# EAGLE design FaboBoard (EAGLE 7.2.0)
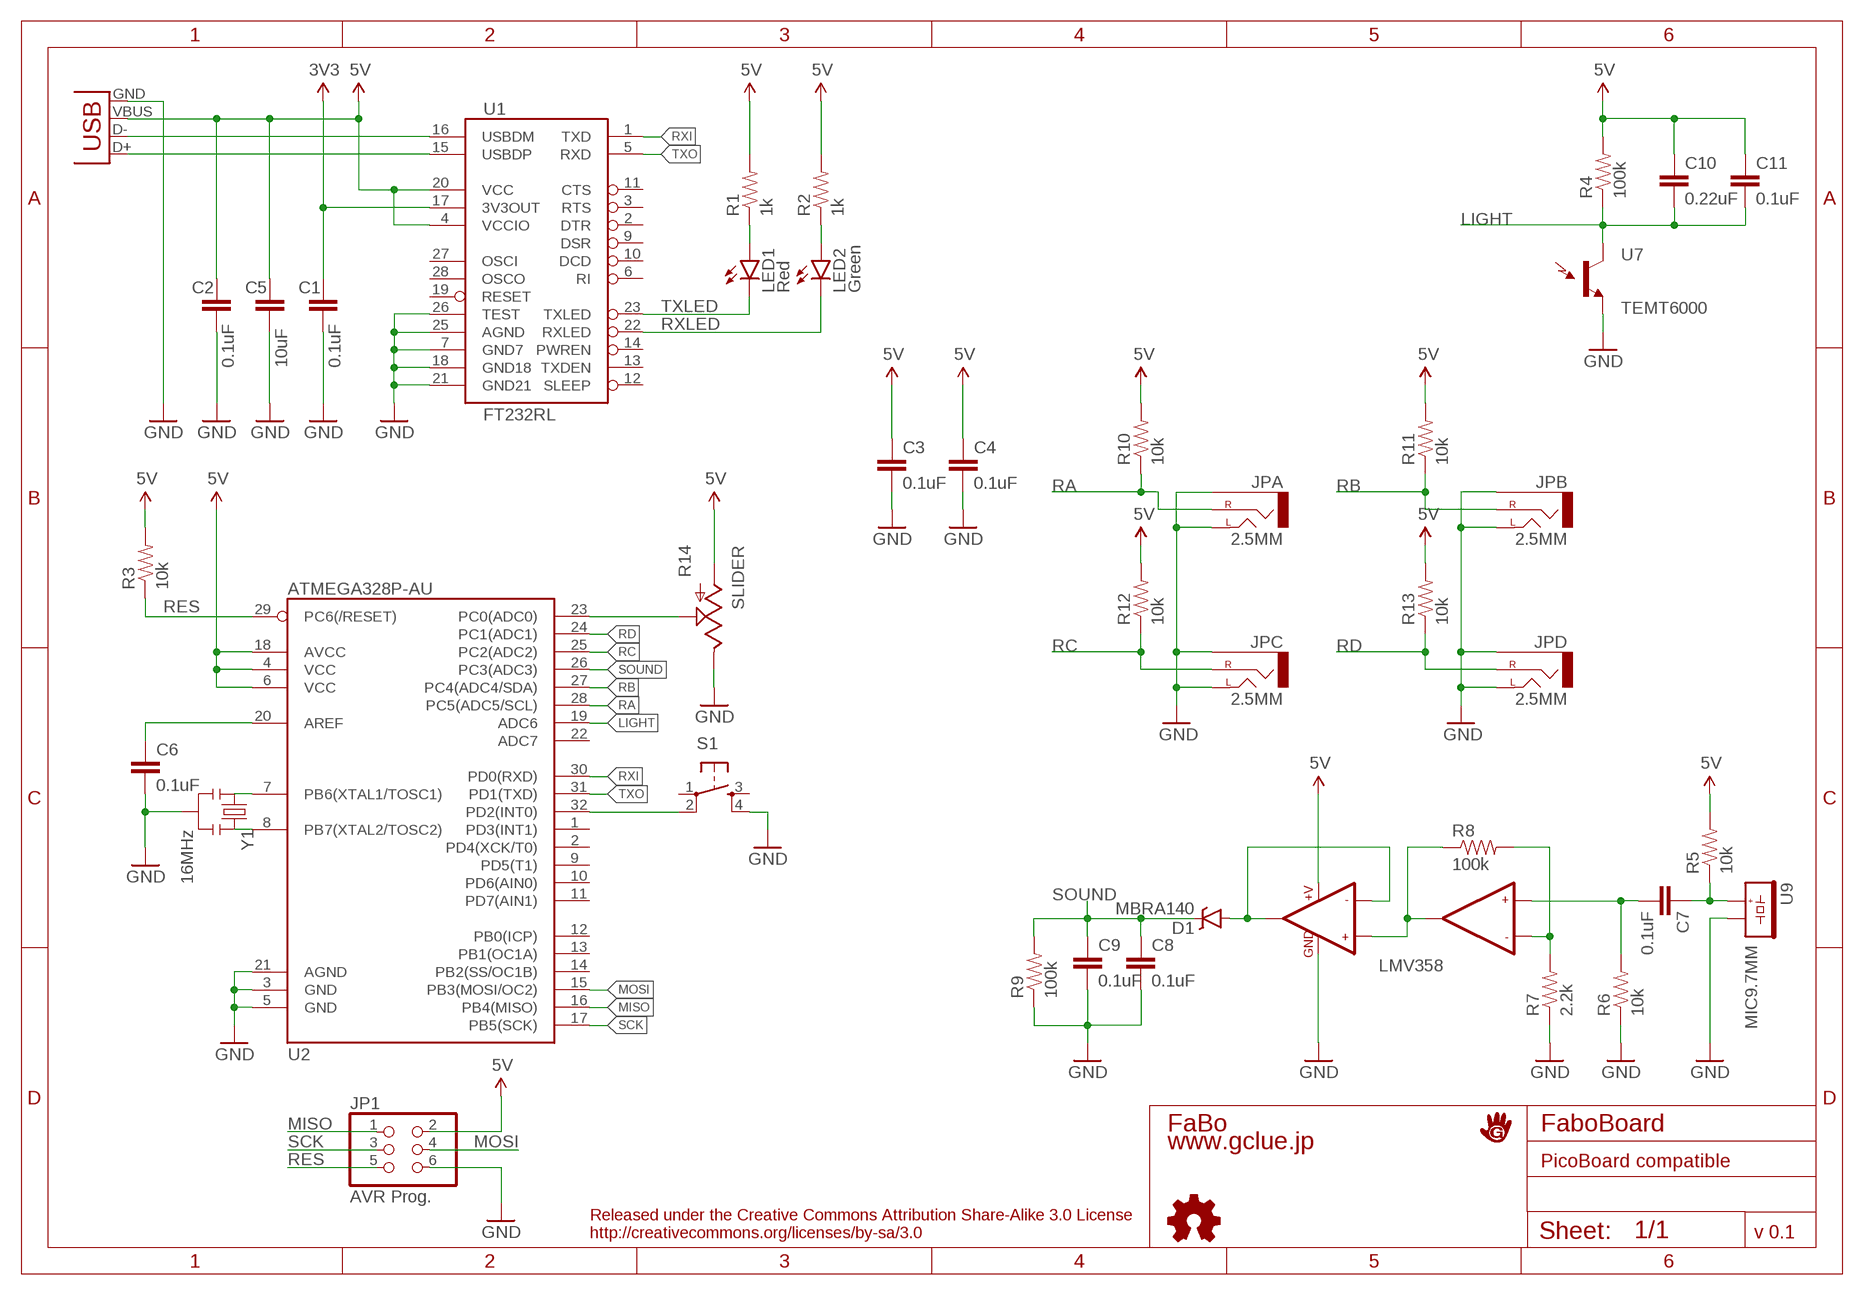
[diagram p0: schematic, sheet 1]

## Parts
C1  0.1uF  CAPACITOR0603  [EIA0603-CAP]
C2  0.1uF  CAPACITOR0603  [EIA0603-CAP]
C3  0.1uF  CAPACITOR0603  [EIA0603-CAP]
C4  0.1uF  CAPACITOR0603  [EIA0603-CAP]
C5  10uF  CAPACITOR1206  [EIA1206]
C6  0.1uF  CAPACITOR0603  [EIA0603-CAP]
C7  0.1uF  CAPACITOR0603  [EIA0603-CAP]
C8  0.1uF  CAPACITOR0603  [EIA0603-CAP]
C9  0.1uF  CAPACITOR0603  [EIA0603-CAP]
C10  0.22uF  CAPACITOR0603  [EIA0603-CAP]
C11  0.1uF  CAPACITOR0603  [EIA0603-CAP]
D1  MBRA140  [DIODE-SMA]
JP1  AVR Prog.  PINHD-2X3  [2X03]
JPA  2.5MM  STEREOJACK_2.5MM_SMD  [STEREOJACK_2.5MM_SMD]
JPB  2.5MM  STEREOJACK_2.5MM_SMD  [STEREOJACK_2.5MM_SMD]
JPC  2.5MM  STEREOJACK_2.5MM_SMD  [STEREOJACK_2.5MM_SMD]
JPD  2.5MM  STEREOJACK_2.5MM_SMD  [STEREOJACK_2.5MM_SMD]
LED1  Red  LED-EIA0603  [EIA0603-LED]
LED2  Green  LED-EIA0603  [EIA0603-LED]
R1  1k  RESISTOR0603  [EIA0603-RES]
R2  1k  RESISTOR0603  [EIA0603-RES]
R3  10k  RESISTOR0603  [EIA0603-RES]
R4  100k  RESISTOR0603  [EIA0603-RES]
R5  10k  RESISTOR0603  [EIA0603-RES]
R6  10k  RESISTOR0603  [EIA0603-RES]
R7  2.2k  RESISTOR0603  [EIA0603-RES]
R8  100k  RESISTOR0603  [EIA0603-RES]
R9  100k  RESISTOR0603  [EIA0603-RES]
R10  10k  RESISTOR0603  [EIA0603-RES]
R11  10k  RESISTOR0603  [EIA0603-RES]
R12  10k  RESISTOR0603  [EIA0603-RES]
R13  10k  RESISTOR0603  [EIA0603-RES]
R14  SLIDER  SLIDER60MM  [SLIDER_60MM]
S1  SWITCH-TL3300CF160Q  [TACT-SMD-12MM-TL3300CF160Q]
U1  FT232RL  [SSOP28]
U2  ATMEGA328P-AU  [TQFP-32-08]
U7  TEMT6000  [TEMT6000]
U8  LMV358  [SO8-OP]
U9  MIC9.7MM  MIC-ECM  [MIC-ECM]
U$2  LOGO_GCLUE  [LOGO_GCLUE]
U$3  LOGO_OSHW-S  [LOGO_OSHW_S]
USB1  USBMICRO_SMD  [USB_B_MICRO]
Y1  16MHz  RESONATOR  [RESONATOR_SMD]

## Nets
3V3 [power]: C1.1 U1.17(3V3OUT)
5V: C2.1 C3.1 C4.1 C5.1 C10.1 C11.1 JP1.2 R1.2 R2.2 R3.2 R4.2 R5.2 R10.2 R11.2 R12.2 R13.2 R14.3 U1.4(VCCIO) U1.20(VCC) U2.4(VCC) U2.6(VCC) U2.18(AVCC) U8.8(+V) USB1.VBUS
GND [power]: C1.2 C2.2 C3.2 C4.2 C5.2 C6.2 C8.2 C9.2 JP1.6 JPA.1(LEFT) JPA.5(SLEEVE) JPB.1(LEFT) JPB.5(SLEEVE) JPC.1(LEFT) JPC.5(SLEEVE) JPD.1(LEFT) JPD.5(SLEEVE) R6.1 R7.1 R9.1 R14.1 S1.4 U1.7(GND7) U1.18(GND18) U1.21(GND21) U1.25(AGND) U1.26(TEST) U2.3(GND) U2.5(GND) U2.21(AGND) U7.EMITTER(E1) U8.4(GND) U9.- USB1.GND Y1.2
LIGHT: C10.2 C11.2 R4.1 U2.19(ADC6) U7.COLLECTOR(C1)
MISO: JP1.1 U2.16(PB4(MISO))
MOSI: JP1.4 U2.15(PB3(MOSI/OC2))
N$1: LED1.A R1.1
N$2: LED2.A R2.1
N$3: R7.2 R8.2 U8.6(-IN2)
N$5: U2.7(PB6(XTAL1/TOSC1)) Y1.1
N$6: U2.8(PB7(XTAL2/TOSC2)) Y1.3
N$7: C6.1 U2.20(AREF)
N$8: S1.2 U2.32(PD2(INT0))
N$9: C7.1 R5.1 U9.+
N$10: R14.2 U2.23(PC0(ADC0))
N$11: C7.2 R6.2 U8.5(+IN2)
N$13: D1.A U8.1(OUT1) U8.2(-IN1)
N$16: R8.1 U8.3(+IN1) U8.7(OUT2)
RA: JPA.4(RIGHT) R10.1 U2.28(PC5(ADC5/SCL))
RB: JPB.4(RIGHT) R11.1 U2.27(PC4(ADC4/SDA))
RC: JPC.4(RIGHT) R12.1 U2.25(PC2(ADC2))
RD: JPD.4(RIGHT) R13.1 U2.24(PC1(ADC1))
RES: JP1.5 R3.1 U2.29(PC6(/RESET))
RXI: U1.1(TXD) U2.30(PD0(RXD))
RXLED: LED2.C U1.22(RXLED)
SCK: JP1.3 U2.17(PB5(SCK))
SOUND: C8.1 C9.1 D1.C R9.2 U2.26(PC3(ADC3))
TXLED: LED1.C U1.23(TXLED)
TXO: U1.5(RXD) U2.31(PD1(TXD))
USB_D+: U1.15(USBDP) USB1.D+
USB_D-: U1.16(USBDM) USB1.D-
Unconnected: S1.1 S1.3 U1.2(DTR) U1.3(RTS) U1.6(RI) U1.9(DSR) U1.10(DCD) U1.11(CTS) U1.12(SLEEP) U1.13(TXDEN) U1.14(PWREN) U1.19(RESET) U1.27(OSCI) U1.28(OSCO) U2.1(PD3(INT1)) U2.2(PD4(XCK/T0)) U2.9(PD5(T1)) U2.10(PD6(AIN0)) U2.11(PD7(AIN1)) U2.12(PB0(ICP)) U2.13(PB1(OC1A)) U2.14(PB2(SS/OC1B)) U2.22(ADC7)

## Notes on the sheet
- PicoBoard compatible
- Released under the Creative Commons Attribution Share-Alike 3.0 License
- http://creativecommons.org/licenses/by-sa/3.0 | v 0.1

## Library data of the parts
C1-C11 = Gclue:CAPACITOR: Capacitor
D1 = Gclue:MBRA140: MBRA140 Schottky Diodes 1A 40V
JP1 = pinhead:PINHD-2X3: PIN HEADER
JPA JPB JPC JPD = Gclue:STEREOJACK_2.5MM_SMD
LED1 LED2 = Gclue:LED: LED
R1-R13 = Gclue:RESISTOR
R14 = Gclue:SLIDER: SLIDER
S1 = Gclue:SWITCH-TL3300CF160Q: Tact Switch SMD 12mm
U1 = Gclue:FT232RL: FT232RL FTDI FT232RL USB to serial UART interface SSOP28
U2 = Gclue:ATMEGA328P-AU: ATmega328p-AU
U7 = gclueSensor:TEMT6000: TEMT6000 Ambient Light Sensor
U8 = Gclue:LMV358: LMV358 Low-Voltage Rail-to-Rail Output OpAmp
U9 = Gclue:MIC-ECM: ECM Microphone C9767
U$2 = Gclue:LOGO_GCLUE
U$3 = Gclue:LOGO_OSHW
USB1 = Gclue:USB
Y1 = Gclue:RESONATOR: RESONATOR CSTCE16M0V53

## Net classes
0 default: width 0.203 mm
1 power: width 0.254 mm
2 GND: width 0.254 mm

## Board
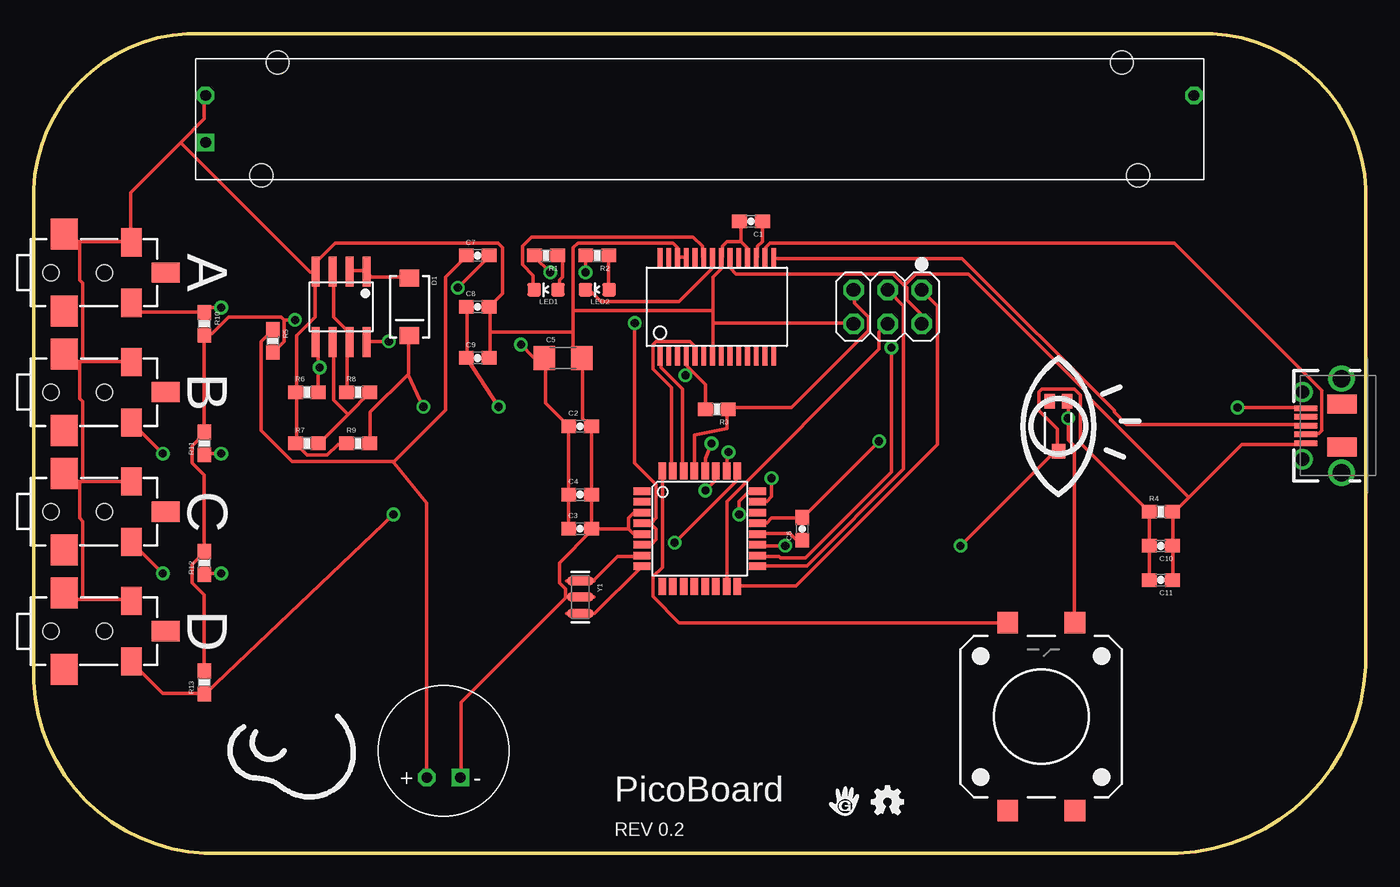
[diagram p1: board, top side]
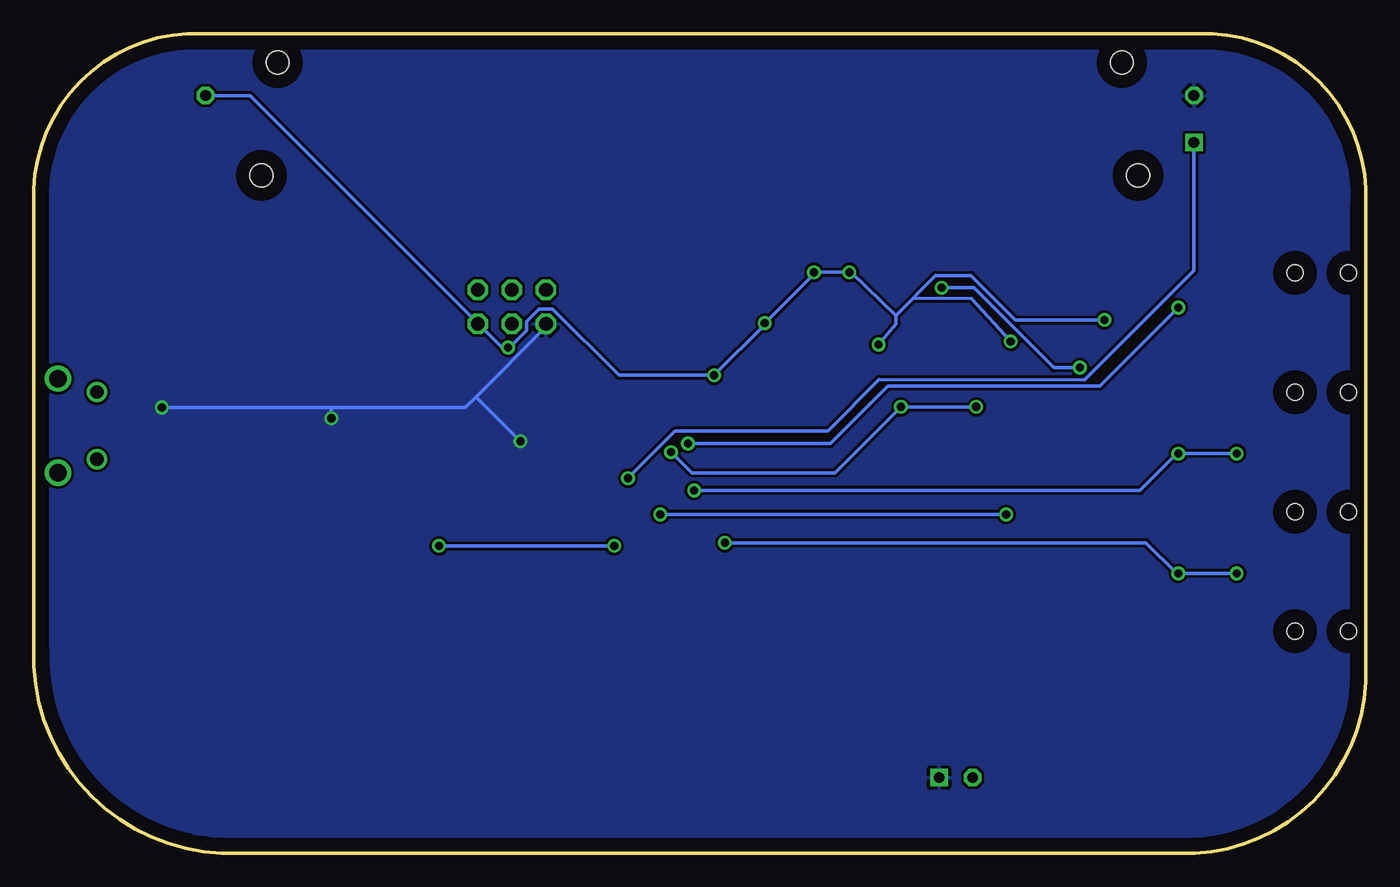
[diagram p2: board, bottom side, seen from below]

Size 99.07 x 60.96 mm. Coordinates in mm from the lower left corner, seen from the top.
Outline: 85.1,0 12.71,0 arc-90 0.01,13.97 0.01,48.26 arc-90 11.44,60.96 87.64,60.96 arc-90 99.07,48.26 99.07,15.24 arc-90 85.1,0
Copper layers (1*16): Top 0.035mm / dielectric 1.5mm / Bottom 0.035mm
Design rules "default": minimum track width 10mil, minimum drill 24mil, track to track 8mil, track to pad 8mil, pad to pad 8mil, via to via 8mil, smd to smd 8mil, copper to edge 40mil, drill to drill 8mil, minimum pad ring 10mil, minimum via ring 8mil, stop-mask expansion 4mil, vias tented up to drill 0mil, thermal gap 10mil

### Footprints (pad centres in the part's own frame; a part is rotated, then mirrored left to right if it is on the bottom)
EIA0603-CAP = smd 1.1 x 1: 1 -0.85,0; 2 0.85,0
EIA1206 = smd 1.6 x 1.8: 1 -1.4,0; 2 1.4,0
DIODE-SMA = smd 1.27 x 1.47: A -2.15,0; C 2.15,0
2X03 = drill 1.016 octagon: 1 -2.54,-1.27; 2 -2.54,1.27; 3 0,-1.27; 4 0,1.27; 5 2.54,-1.27; 6 2.54,1.27
STEREOJACK_2.5MM_SMD = smd 1.5 x 2.1: 1 6,2.25; 4 6,-2.25 | smd 2.1 x 1.5: 3 8.55,0 | smd 2 x 2.3: 5 1,2.85; A 1,-2.85 | hole 1.2: 0,0; 4,0
EIA0603-LED = smd 1 x 1: A 0,-0.877; C 0,0.877
EIA0603-RES = smd 1.1 x 1: 1 -0.85,0; 2 0.85,0
SLIDER_60MM = drill 0.8 octagon: 1 -36.75,1.75; 3 36.75,1.75 | drill 0.8 square: 2 -36.75,-1.75 | hole 1.7: 31.4,4.2; -31.4,4.2; -32.6,-4.2; 32.6,-4.2
TACT-SMD-12MM-TL3300CF160Q = smd 1.6 x 1.55: 1 -6.975,2.5; 2 6.975,2.5; 3 -6.975,-2.5; 4 6.975,-2.5
SSOP28 = smd 0.348 x 1.397: 1 -4.225,-3.656; 2 -3.575,-3.656; 3 -2.925,-3.656; 4 -2.275,-3.656; 5 -1.625,-3.656; 6 -0.975,-3.656; 7 -0.325,-3.656; 8 0.325,-3.656; 9 0.975,-3.656; 10 1.625,-3.656; 11 2.275,-3.656; 12 2.925,-3.656; 13 3.575,-3.656; 14 4.225,-3.656; 15 4.225,3.656; 16 3.575,3.656; 17 2.925,3.656; 18 2.275,3.656; 19 1.625,3.656; 20 0.975,3.656; 21 0.325,3.656; 22 -0.325,3.656; 23 -0.975,3.656; 24 -1.625,3.656; 25 -2.275,3.656; 26 -2.925,3.656; 27 -3.575,3.656; 28 -4.225,3.656
TQFP-32-08 = smd 1.27 x 0.559: 1 -4.293,2.8; 2 -4.293,2; 3 -4.293,1.2; 4 -4.293,0.4; 5 -4.293,-0.4; 6 -4.293,-1.2; 7 -4.293,-2; 8 -4.293,-2.8; 17 4.293,-2.8; 18 4.293,-2; 19 4.293,-1.2; 20 4.293,-0.4; 21 4.293,0.4; 22 4.293,1.2; 23 4.293,2; 24 4.293,2.8 | smd 0.559 x 1.27: 9 -2.8,-4.293; 10 -2,-4.293; 11 -1.2,-4.293; 12 -0.4,-4.293; 13 0.4,-4.293; 14 1.2,-4.293; 15 2,-4.293; 16 2.8,-4.293; 25 2.8,4.293; 26 2,4.293; 27 1.2,4.293; 28 0.4,4.293; 29 -0.4,4.293; 30 -1.2,4.293; 31 -2,4.293; 32 -2.8,4.293
TEMT6000 = smd 1.1 x 0.8: BASE -1.87,-0.65; EMITTER -1.87,0.65 | smd 1.1 x 1: COLLECTOR 1.86,0.01
SO8-OP = smd 0.61 x 2.21: 1 -1.905,-2.616; 2 -0.635,-2.616; 3 0.635,-2.616; 4 1.905,-2.616; 5 1.905,2.616; 6 0.635,2.616; 7 -0.635,2.616; 8 -1.905,2.616
MIC-ECM = drill 0.8 octagon: + 1.25,2 | drill 0.8 square: - -1.25,2
USB_B_MICRO = smd 1.7 x 0.4: D+ 2.1,0; D- 2.1,0.65; GND 2.1,-1.3; ID 2.1,-0.65; VBUS 2.1,1.3 | drill 1 pad 1.4: P$1 2.35,2.5; P$2 2.35,-2.5 | drill 1.3 pad 1.7: P$3 -0.55,3.5; P$4 -0.55,-3.5 | smd 2.2 x 1.4: P$6 -0.6,1.6; P$7 -0.6,-1.6
RESONATOR_SMD = smd 0.7 x 2: 1 -1.2,0; 2 0,0; 3 1.2,0

### Placement (x,y rotation side)
C1  53.35,46.99 180 top
C2  40.65,31.75 0 top
C3  40.65,24.13 0 top
C4  40.65,26.67 0 top
C5  39.38,36.83 0 top
C6  57.16,24.13 90 top
C7  33.03,44.45 0 top
C8  33.03,40.64 0 top
C9  33.03,36.83 0 top
C10  83.83,22.86 180 top
C11  83.83,20.32 180 top
D1  27.95,40.64 270 top
JP1  63.51,40.64 180 top
JPA  1.28,43.18 0 top
JPB  1.28,34.29 0 top
JPC  1.28,25.4 0 top
JPD  1.28,16.51 0 top
LED1  38.11,41.91 90 top
LED2  41.92,41.91 90 top
R1  38.11,44.45 180 top
R2  41.92,44.45 180 top
R3  50.81,33.02 180 top
R4  83.83,25.4 0 top
R5  17.79,38.1 270 top
R6  20.33,34.29 0 top
R7  20.33,30.48 0 top
R8  24.14,34.29 0 top
R9  24.14,30.48 0 top
R10  12.71,39.37 270 top
R11  12.71,30.48 90 top
R12  12.71,21.59 90 top
R13  12.71,12.7 90 top
R14  49.54,54.61 0 top
S1  74.94,10.16 90 top
U1  50.81,40.64 0 top
U2  49.54,24.13 0 top
U7  76.21,31.75 270 top
U8  22.87,40.64 180 top
U9  30.49,7.62 180 top
U$2  60.33,3.81 0 top
U$3  63.51,3.81 0 top
USB1  96.71,31.8 180 top
Y1  40.65,19.05 270 top

### Tracks (layer width: path | path; a pad name or v marks a point on that pad's centre or on a via)
3V3
  Top 0.254: C1.1 54.19,46.98 54.19,45.49 53.84,45.15 53.84,44.35 U1.17
5V  (via drill 0.61)
  Top 0.254: R13.2 12.69,13.6 12.69,19.2 11.78,20.12 11.78,21.49 12.69,22.4 R12.2 12.69,22.52 12.69,28.12 11.78,29.03 11.78,30.29 12.69,31.2 R11.2 12.69,31.43 12.69,38.52 R10.2 12.81,38.63 13.27,38.63 14.52,39.89 18.41,39.89 18.64,39.66 | 18.64,39.66 18.64,38.06 17.84,37.26 R5.2 | C3.1 39.78,24.23 39.78,26.63 C4.1 39.78,26.75 39.78,31.66 C2.1 39.78,31.77 38.07,33.49 38.07,36.8 C5.1 37.96,36.92 37.16,36.92 v36.24,37.83 | 48.87,35.95 48.59,36.23 48.59,36.92 U1.4 | 48.87,35.95 49.96,34.86 49.96,33.03 R3.2 | 45.96,24.46 46.3,24.12 46.3,23.32 45.96,22.97 45.27,22.97 U2.6 | 45.96,24.46 45.27,24.46 U2.4 | v38.41,43.2 37.27,44.35 R1.2 | v41.04,43.2 41.04,44.35 R2.2 | v44.7,39.43 44.7,29.03 46.3,27.43 46.3,24.92 45.96,24.57 45.96,24.46 | v26.41,38.06 24.81,38.06 U8.8 | v48.47,35.55 48.87,35.95 | v19.44,39.66 18.64,39.66 | C11.1 84.7,20.34 84.7,22.86 C10.1 84.7,22.97 84.7,25.38 R4.2 84.82,25.38 85.9,26.46 | 85.9,26.46 89.85,30.4 94.53,30.4 USB1.VBUS | v63.79,37.6 63.79,28.35 57.39,21.95 55.56,21.95 55.44,22.06 53.84,22.06 U2.18 | 64.76,42.23 64.93,42.06 64.93,41.15 65.96,40.12 65.96,39.43 JP1.2 | 64.76,42.23 63.9,43.09 52.24,43.09 51.79,43.55 51.79,44.23 U1.20 | 85.9,26.46 78.3,34.06 78.3,34.29 69.5,43.09 65.62,43.09 64.76,42.23
  Bottom 0.254: v26.41,38.06 29.34,41.24 33.66,41.27 34.93,40.01 | 34.93,40.01 38.3,43.2 v38.41,43.2 v41.04,43.2 41.04,43.09 v44.7,39.43 44.7,39.32 v48.47,35.55 55.56,35.55 60.47,40.46 61.5,40.46 62.42,39.55 62.42,38.86 63.67,37.6 v63.79,37.6 64.24,37.6 65.96,39.32 JP1.2 66.07,39.43 82.99,56.35 86.19,56.35 R14.3 | 34.93,40.01 34.93,39.37 v36.24,37.83 | v19.44,39.66 26.07,39.66 29.38,42.98 32.01,42.98 34.93,40.01
GND  (via drill 0.61)
  Top 0.254: U7.EMITTER 76.93,33.6 v76.93,32.35 76.93,30.75 77.39,30.29 77.39,17.14 S1.4 | U2.21 53.84,24.57 54.53,24.57 54.87,24.92 57.16,24.92 C6.2 57.27,25.03 v62.87,30.63 | v89.53,33.15 94.53,33.15 USB1.GND | 3.67,18.86 2.75,18.86 2.29,19.32 JPD.5 | 3.67,18.86 7.21,18.86 JPD.1 | 3.44,27.66 2.86,27.66 2.29,28.23 JPC.5 | 3.44,27.66 3.67,27.66 | 3.67,27.66 7.21,27.66 JPC.1 | 3.67,18.86 3.67,24.69 3.44,24.92 3.44,27.66 | R9.1 23.21,30.4 22.64,30.4 21.84,29.6 20.35,29.6 19.55,30.4 R7.1 19.55,30.52 19.55,34.29 R6.1 19.55,34.4 19.55,38.52 20.92,39.89 20.92,43.2 U8.4 | 3.44,36.58 2.75,36.58 2.29,37.03 JPB.5 | 3.44,36.58 3.67,36.58 | 3.67,36.58 7.21,36.58 JPB.1 | 3.44,45.49 2.75,45.49 2.29,45.95 JPA.5 | 3.44,45.49 7.21,45.49 JPA.1 7.21,45.61 7.21,49.15 10.92,52.86 | 10.92,52.86 12.69,54.63 12.69,56.35 R14.1 | 3.67,36.58 3.67,42.41 3.44,42.63 3.44,45.49 | 10.92,52.86 20.58,43.2 20.81,43.2 U8.4 | 3.67,27.66 3.67,33.6 3.44,33.83 3.44,36.58 | 52.59,45.49 52.59,46.98 C1.2 | 52.59,45.49 53.04,45.03 53.04,44.35 U1.18 | 50.53,40.35 50.53,42.86 51.1,43.43 51.1,44.23 U1.21 51.21,44.35 51.21,45.15 51.56,45.49 52.59,45.49 | 50.53,40.35 50.53,39.43 | 50.53,39.43 50.53,37.03 U1.7 | 33.95,38.75 33.95,40.58 C8.2 33.95,40.69 34.87,41.6 34.87,45.03 34.53,45.38 22.41,45.38 21.04,44.01 21.04,43.32 U8.4 | 33.95,38.75 33.95,36.92 C9.2 | U1.25 48.47,44.35 47.9,44.35 U1.26 47.9,44.46 47.9,45.03 47.56,45.38 40.47,45.38 40.13,45.03 40.13,40.35 | 40.13,38.75 40.13,37.49 40.7,36.92 C5.2 40.81,36.8 40.81,32.35 41.38,31.77 C2.2 41.5,31.66 41.5,26.75 C4.2 41.5,26.63 41.5,24.23 C3.2 | 40.13,38.75 40.13,40.35
  Top 0.254: 40.13,38.75 33.95,38.75 | 40.13,40.35 50.53,40.35 | 44.24,24.12 44.58,23.77 45.16,23.77 U2.5 | 44.24,24.12 44.24,24.92 44.58,25.26 45.16,25.26 U2.3 | 44.24,24.12 41.61,24.12 C3.2 | C3.2 41.5,24 39.1,21.6 39.1,20.12 39.56,19.66 39.56,19.09 39.63,19.05 31.78,11.2 31.78,5.71 U9.- | 50.53,39.43 60.93,39.43 JP1.6
  Bottom 0.254: 76.93,33.15 66.99,33.15 66.19,33.95 | 76.93,33.15 v89.53,33.15 | 66.19,33.95 61.04,39.09 61.04,39.32 JP1.6 | 66.19,33.95 v62.87,30.63 | 76.93,33.15 v76.93,32.35
  pour Bottom: -2.53,62.23 101.61,62.23 101.61,-1.27 -2.53,-1.27
LIGHT  (via drill 0.61)
  Top 0.254: C11.2 82.99,20.34 82.99,22.86 C10.2 82.99,22.97 82.99,25.38 R4.1 82.88,25.49 77.85,30.52 77.85,34.06 77.39,34.52 74.99,34.52 74.76,34.29 74.76,32.92 76.13,31.55 76.13,29.95 U7.COLLECTOR 76.02,29.95 v68.93,22.86 | v55.9,22.86 53.84,22.86 U2.19
  Bottom 0.254: v68.93,22.86 v55.9,22.86
MISO
  Top 0.254: U2.16 52.36,19.89 56.7,19.89 67.22,30.4 67.22,40.69 66.07,41.83 JP1.1
MOSI
  Top 0.254: U2.15 51.56,19.89 51.56,26.18 62.87,37.49 62.87,38.75 63.44,39.32 JP1.4
N$1
  Top 0.254: LED1.A 39.1,41.95 39.1,42.63 39.33,42.86 39.33,44.01 38.98,44.35 R1.1
N$2
  Top 0.254: LED2.A 42.76,41.95 42.76,44.35 R2.1
N$3
  Top 0.254: 23.38,32.63 25.04,34.29 R8.2 | 23.38,32.63 21.27,30.52 R7.2 | 23.38,32.63 22.3,33.72 22.3,37.95 U8.6
N$5
  Top 0.254: U2.7 45.16,22.06 43.44,22.06 41.73,20.34 Y1.1
N$6
  Top 0.254: U2.8 45.16,21.26 41.73,17.83 Y1.3
N$7
  Top 0.254: C6.1 57.16,23.32 56.7,23.32 56.24,23.77 53.84,23.77 U2.20
N$8
  Top 0.254: U2.32 46.76,28.35 46.76,21.26 46.07,20.57 46.07,19.09 48.01,17.14 72.36,17.14 S1.2
N$9
  Top 0.254: 26.82,29.15 19.21,29.15 16.92,31.43 16.92,38.06 17.72,38.86 R5.1 | 26.82,29.15 30.64,32.97 30.64,42.86 32.13,44.35 C7.1 | U9.+ 29.22,5.71 29.22,26.04 26.82,29.03 26.82,29.15
N$10  (via drill 0.61)
  Top 0.254: v54.87,27.89 54.87,26.52 54.53,26.18 53.84,26.18 U2.23
  Bottom 0.254: v54.87,27.89 51.37,31.39 40.01,31.39 36.2,35.24 20.92,35.2 12.81,43.32 12.81,52.81 R14.2
N$11  (via drill 0.61)
  Top 0.254: 21.15,36.12 21.15,37.83 U8.5 | 21.15,36.12 21.15,34.29 R6.2 | v31.55,42.06 33.84,44.35 C7.2 | v21.27,36.12 21.15,36.12
  Bottom 0.254: v31.55,42.06 29.15,42.06 23.21,36.12 v21.27,36.12
N$13
  Top 0.254: D1.A 27.9,42.86 25.15,42.86 24.81,43.2 U8.1 24.7,43.32 23.55,43.32 U8.2
N$16
  Top 0.254: R8.1 23.32,34.29 23.32,37.83 23.44,37.95 U8.7 23.44,38.06 23.44,38.75 22.3,39.89 22.3,43.2 U8.3
RA  (via drill 0.61)
  Top 0.254: JPA.4 7.32,40.92 8.01,40.23 12.69,40.23 R10.1 12.81,40.23 13.15,40.58 v13.95,40.58 | v50.41,30.47 49.96,29.38 49.96,28.46 U2.28
  Bottom 0.254: v50.41,30.47 39.83,30.47 35.55,34.75 19.78,34.75 v13.95,40.58
RB  (via drill 0.61)
  Top 0.254: v13.95,29.72 12.81,29.72 R11.1 | v9.61,29.72 7.32,32 JPB.4 | v49.96,26.98 50.64,27.66 50.64,28.35 U2.27
  Bottom 0.254: v9.61,29.72 v13.95,29.72 14.07,29.72 16.81,26.98 v49.96,26.98
RC  (via drill 0.61)
  Top 0.254: v13.95,20.8 12.81,20.8 R12.1 | v9.61,20.8 7.32,23.09 JPC.4 | v47.67,23.09 52.24,27.66 52.24,28.35 U2.25
  Bottom 0.254: v9.61,20.8 v13.95,20.8 14.07,20.8 16.35,23.09 v47.67,23.09
RD  (via drill 0.61)
  Top 0.254: JPD.4 7.32,14.17 9.61,11.89 12.69,11.89 R13.1 12.81,11.89 v26.75,25.2 | v52.47,25.2 52.47,26.18 53.16,26.86 53.73,26.86 U2.24
  Bottom 0.254: v26.75,25.2 v52.47,25.2
RES
  Top 0.254: U2.29 49.16,28.46 49.16,31.1 51.56,31.6 51.56,32.92 R3.1 51.67,33.15 56.36,33.15 62.07,38.86 62.07,39.89 61.04,40.92 61.04,41.83 JP1.5
RXI
  Top 0.254: U2.30 48.24,28.46 48.24,34.52 46.64,36.12 46.64,36.92 U1.1
RXLED
  Top 0.254: LED2.C 41.04,41.83 41.38,41.83 42.18,41.03 48.01,41.03 50.41,43.43 50.41,44.23 U1.22
SCK
  Top 0.254: U2.17 53.84,21.37 57.5,21.37 64.7,28.57 64.7,40.69 63.56,41.83 JP1.3
SOUND  (via drill 0.61)
  Top 0.254: 27.84,35.6 27.9,35.66 27.9,38.41 D1.C | 27.84,35.6 25.04,32.8 25.04,30.52 R9.2 | C8.1 32.24,40.58 32.24,36.92 C9.1 32.24,36.8 v34.58,33.2 | v51.67,29.83 51.56,29.72 51.56,28.46 U2.26 | v28.98,33.2 27.84,35.6
  Bottom 0.254: v51.67,29.83 50.12,28.28 39.49,28.28 v34.58,33.2 v28.98,33.2
TXLED
  Top 0.254: LED1.C 37.16,41.95 37.16,42.98 36.35,43.78 36.35,45.15 37.04,45.83 49.04,45.83 49.73,45.15 49.73,44.35 U1.23
TXO
  Top 0.254: U2.31 47.44,28.46 47.44,34.63 46.07,36.01 46.07,37.83 46.3,38.06 48.81,38.06 49.16,37.72 49.16,37.03 U1.5
USB_D+
  Top 0.254: U1.15 55.1,44.23 69.04,44.23 80.36,32.92 80.36,32.8 81.27,31.89 94.53,31.89 USB1.D+
USB_D-
  Top 0.254: U1.16 54.41,44.35 54.41,45.03 54.76,45.38 84.82,45.38 95.79,34.4 95.79,31.43 95.56,31.2 94.65,31.2 USB1.D-

### Text on the board
tPlace: A | B | C | D | PicoBoard | REV 0.2